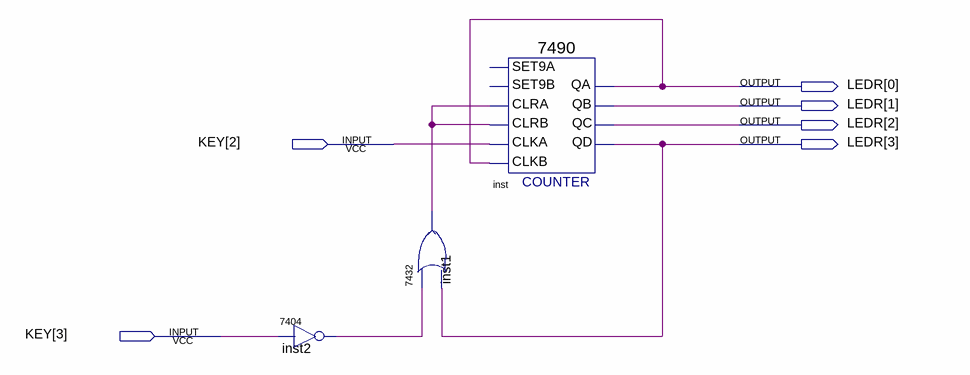
[diagram p0: schematic sheet]
// Quartus schematic mod8counter.bdf as structural Verilog: 3 symbols, 6 pins
module mod8counter (
  input  [3:2] KEY,
  output [3:0] LEDR
);

  wire inst1_1, inst2_1;

  \7404  inst2 (.\2 (KEY[3]), .\1 (inst2_1));
  \7432  inst1 (.\2 (inst2_1), .\3 (LEDR[3]), .\1 (inst1_1));
  \7490  inst (
    .CLRA(inst1_1), .CLKB(LEDR[0]), .CLKA(KEY[2]), .CLRB(inst1_1), .QD(LEDR[3]), .QA(LEDR[0]), .QB(LEDR[1]),
    .QC(LEDR[2]));  // open: SET9A, SET9B
endmodule
